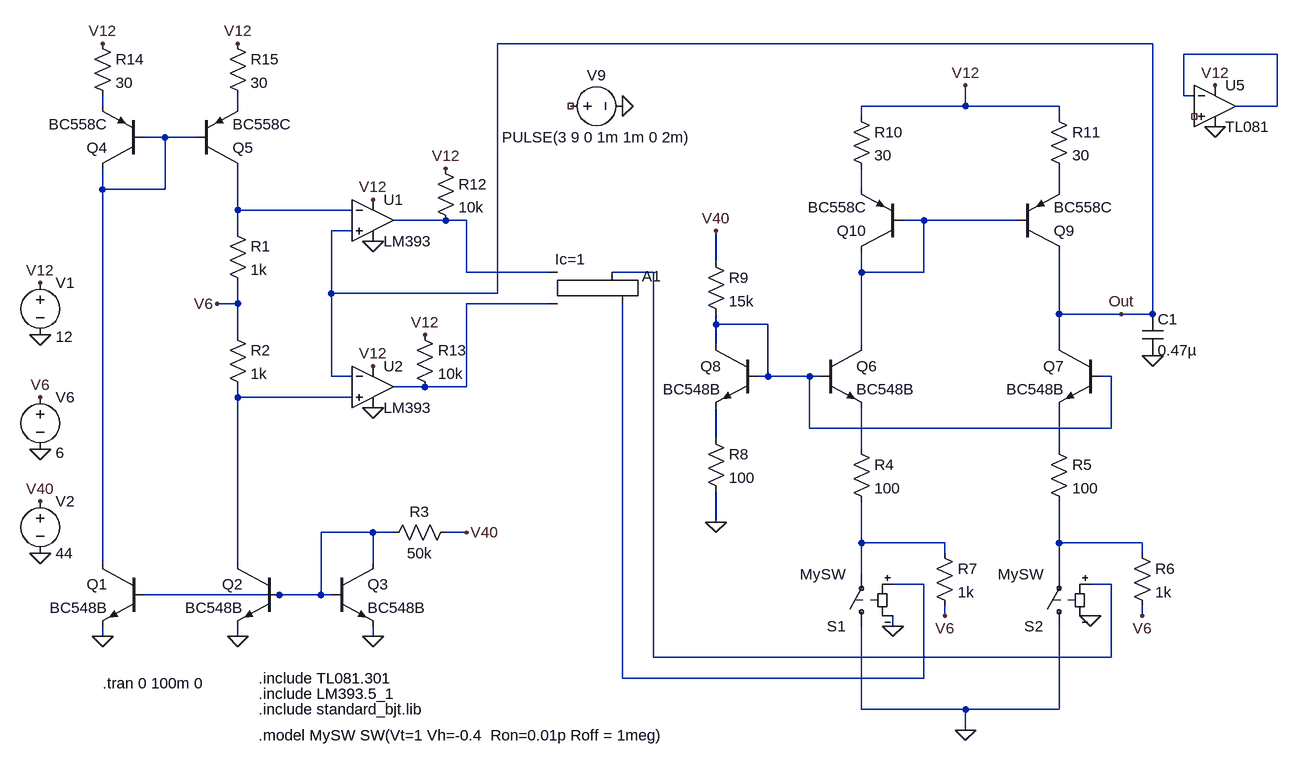
[diagram p0: schematic Gen_triangular_v5.asc]
Gen_triangular_v5.asc, the LTspice schematic file:
Version 4
SHEET 1 2480 932
WIRE 1792 -528 784 -528
WIRE 1984 -512 1840 -512
WIRE 1840 -448 1840 -512
WIRE 1856 -448 1840 -448
WIRE 176 -432 176 -448
WIRE 384 -432 384 -448
WIRE 1504 -432 1504 -464
WIRE 1504 -432 1344 -432
WIRE 1648 -432 1504 -432
WIRE 1984 -432 1984 -512
WIRE 1984 -432 1920 -432
WIRE 1344 -416 1344 -432
WIRE 1648 -416 1648 -432
WIRE 272 -384 240 -384
WIRE 320 -384 272 -384
WIRE 176 -304 176 -336
WIRE 272 -304 272 -384
WIRE 272 -304 176 -304
WIRE 1344 -304 1344 -336
WIRE 1648 -304 1648 -336
WIRE 384 -272 384 -336
WIRE 560 -272 384 -272
WIRE 704 -256 624 -256
WIRE 736 -256 704 -256
WIRE 1440 -256 1408 -256
WIRE 1584 -256 1440 -256
WIRE 384 -240 384 -272
WIRE 560 -240 528 -240
WIRE 1120 -192 1120 -240
WIRE 736 -176 736 -256
WIRE 864 -176 736 -176
WIRE 1024 -176 960 -176
WIRE 1344 -176 1344 -208
WIRE 1440 -176 1440 -256
WIRE 1440 -176 1344 -176
WIRE 528 -144 528 -240
WIRE 784 -144 784 -528
WIRE 784 -144 528 -144
WIRE 384 -128 384 -160
WIRE 384 -128 352 -128
WIRE 864 -128 736 -128
WIRE 1648 -112 1648 -208
WIRE 1744 -112 1648 -112
WIRE 1792 -112 1792 -528
WIRE 1792 -112 1744 -112
WIRE 1120 -96 1120 -112
WIRE 1200 -96 1120 -96
WIRE 384 -80 384 -128
WIRE 1120 -64 1120 -96
WIRE 1344 -64 1344 -176
WIRE 1648 -64 1648 -112
WIRE 528 -16 528 -144
WIRE 560 -16 528 -16
WIRE 1200 -16 1200 -96
WIRE 1200 -16 1184 -16
WIRE 1264 -16 1200 -16
WIRE 1280 -16 1264 -16
WIRE 1728 -16 1712 -16
WIRE 672 0 624 0
WIRE 736 0 736 -128
WIRE 736 0 672 0
WIRE 384 16 384 0
WIRE 560 16 384 16
WIRE 1264 64 1264 -16
WIRE 1728 64 1728 -16
WIRE 1728 64 1264 64
WIRE 1120 80 1120 32
WIRE 1344 96 1344 32
WIRE 1648 96 1648 32
WIRE 1120 208 1120 160
WIRE 592 224 512 224
WIRE 624 224 592 224
WIRE 736 224 704 224
WIRE 1344 240 1344 176
WIRE 1472 240 1344 240
WIRE 1648 240 1648 176
WIRE 1776 240 1648 240
WIRE 1472 256 1472 240
WIRE 1776 256 1776 240
WIRE 176 272 176 -304
WIRE 384 272 384 16
WIRE 592 272 592 224
WIRE 1344 288 1344 240
WIRE 1648 288 1648 240
WIRE 1440 304 1392 304
WIRE 1728 304 1696 304
WIRE 448 320 240 320
WIRE 512 320 512 224
WIRE 512 320 448 320
WIRE 528 320 512 320
WIRE 1472 352 1472 336
WIRE 1776 352 1776 336
WIRE 1392 368 1392 352
WIRE 176 384 176 368
WIRE 384 384 384 368
WIRE 592 384 592 368
WIRE 1024 416 1024 -176
WIRE 1728 416 1728 304
WIRE 1728 416 1024 416
WIRE 976 448 976 -128
WIRE 1440 448 1440 304
WIRE 1440 448 976 448
WIRE 1344 496 1344 368
WIRE 1504 496 1344 496
WIRE 1648 496 1648 368
WIRE 1648 496 1504 496
WIRE 1504 528 1504 496
FLAG 592 384 0
FLAG 384 384 0
FLAG 176 384 0
FLAG 80 -80 0
FLAG 352 -128 V6
FLAG 80 -160 V12
FLAG 384 -528 V12
FLAG 176 -528 V12
FLAG 592 -224 0
FLAG 592 32 0
FLAG 592 -288 V12
FLAG 592 -32 V12
FLAG 1888 -400 0
FLAG 1888 -464 V12
FLAG 1120 208 0
FLAG 1776 352 V6
FLAG 1472 352 V6
FLAG 1120 -240 V40
FLAG 1792 -48 0
FLAG 1504 -464 V12
FLAG 1744 -112 Out
FLAG 80 96 0
FLAG 80 16 V6
FLAG 1504 528 0
FLAG 1392 368 0
FLAG 1696 352 0
FLAG 704 -336 V12
FLAG 672 -80 V12
FLAG 976 -432 0
FLAG 80 256 0
FLAG 80 176 V40
FLAG 736 224 V40
SYMBOL npn 240 272 M0
SYMATTR InstName Q1
SYMATTR Value BC548B
SYMBOL npn 448 272 M0
SYMATTR InstName Q2
SYMATTR Value BC548B
SYMBOL npn 528 272 R0
SYMATTR InstName Q3
SYMATTR Value BC548B
SYMBOL pnp 240 -336 R180
SYMATTR InstName Q4
SYMATTR Value BC558C
SYMBOL pnp 320 -336 M180
SYMATTR InstName Q5
SYMATTR Value BC558C
SYMBOL res 368 -256 R0
SYMATTR InstName R1
SYMATTR Value 1k
SYMBOL res 368 -96 R0
SYMATTR InstName R2
SYMATTR Value 1k
SYMBOL voltage 80 -176 R0
WINDOW 123 0 0 Left 0
WINDOW 39 0 0 Left 0
WINDOW 3 24 99 Left 2
SYMATTR Value 12
SYMATTR InstName V1
SYMBOL Opamps\\opamp2 592 -320 R0
SYMATTR InstName U1
SYMATTR Value LM393
SYMBOL Opamps\\opamp2 592 -64 R0
SYMATTR InstName U2
SYMATTR Value LM393
SYMBOL Digital\\srflop 912 -224 R0
WINDOW 3 -40 28 Left 2
SYMATTR Value Ic=1
SYMATTR InstName A1
SYMBOL Opamps\\opamp2 1888 -496 R0
SYMATTR InstName U5
SYMATTR Value TL081
SYMBOL npn 1280 -64 R0
SYMATTR InstName Q6
SYMATTR Value BC548B
SYMBOL npn 1712 -64 M0
SYMATTR InstName Q7
SYMATTR Value BC548B
SYMBOL res 1328 80 R0
SYMATTR InstName R4
SYMATTR Value 100
SYMBOL res 1632 80 R0
SYMATTR InstName R5
SYMATTR Value 100
SYMBOL res 1760 240 R0
SYMATTR InstName R6
SYMATTR Value 1k
SYMBOL res 1456 240 R0
SYMATTR InstName R7
SYMATTR Value 1k
SYMBOL npn 1184 -64 M0
SYMATTR InstName Q8
SYMATTR Value BC548B
SYMBOL res 1104 64 R0
SYMATTR InstName R8
SYMATTR Value 100
SYMBOL res 1104 -208 R0
SYMATTR InstName R9
SYMATTR Value 15k
SYMBOL cap 1776 -112 R0
SYMATTR InstName C1
SYMATTR Value 0.47µ
SYMBOL pnp 1584 -208 M180
SYMATTR InstName Q9
SYMATTR Value BC558C
SYMBOL pnp 1408 -208 R180
SYMATTR InstName Q10
SYMATTR Value BC558C
SYMBOL res 1328 -432 R0
SYMATTR InstName R10
SYMATTR Value 30
SYMBOL res 1632 -432 R0
SYMATTR InstName R11
SYMATTR Value 30
SYMBOL voltage 80 0 R0
WINDOW 123 0 0 Left 0
WINDOW 39 0 0 Left 0
WINDOW 3 24 101 Left 2
SYMATTR InstName V6
SYMATTR Value 6
SYMBOL sw 1344 384 R180
SYMATTR InstName S1
SYMATTR Value MySW
SYMBOL sw 1648 384 R180
SYMATTR InstName S2
SYMATTR Value MySW
SYMBOL res 688 -352 R0
SYMATTR InstName R12
SYMATTR Value 10k
SYMBOL res 656 -96 R0
SYMATTR InstName R13
SYMATTR Value 10k
SYMBOL voltage 880 -432 R270
WINDOW 0 32 56 VTop 2
WINDOW 3 -32 56 VBottom 2
WINDOW 123 0 0 Left 0
WINDOW 39 0 0 Left 0
SYMATTR InstName V9
SYMATTR Value PULSE(3 9 0 1m 1m 0 2m)
SYMBOL res 160 -544 R0
SYMATTR InstName R14
SYMATTR Value 30
SYMBOL res 368 -544 R0
SYMATTR InstName R15
SYMATTR Value 30
SYMBOL res 720 208 R90
WINDOW 0 0 56 VBottom 2
WINDOW 3 32 56 VTop 2
SYMATTR InstName R3
SYMATTR Value 50k
SYMBOL voltage 80 160 R0
WINDOW 123 0 0 Left 0
WINDOW 39 0 0 Left 0
SYMATTR InstName V2
SYMATTR Value 44
TEXT 416 496 Left 2 !.include standard_bjt.lib
TEXT 176 456 Left 2 !.tran 0 100m 0
TEXT 416 472 Left 2 !.include LM393.5_1
TEXT 416 448 Left 2 !.include TL081.301
TEXT 416 536 Left 2 !.model MySW SW(Vt=1 Vh=-0.4  Ron=0.01p Roff = 1meg)

The netlist it stands for:
* Gen_triangular_v5.asc
Q1 N004 N017 0 0 BC548B
Q2 N013 N017 0 0 BC548B
Q3 N017 N017 0 0 BC548B
Q4 N004 N004 N002 0 BC558C
Q5 N007 N004 N003 0 BC558C
R1 N007 V6 1k
R2 V6 N013 1k
V1 V12 0 12
XU1 Out N007 V12 0 N008 LM393  ; pins In+ In- V+ V- OUT
XU2 N013 Out V12 0 N011 LM393  ; pins In+ In- V+ V- OUT
A1 N008 N011 0 0 0 N020 N010 0 SRFLOP Ic=1
XU5 NC_01 N001 V12 0 N001 TL081  ; pins In+ In- V+ V- OUT
Q6 N009 N012 N015 0 BC548B
Q7 Out N012 N016 0 BC548B
R4 N015 N018 100
R5 N016 N019 100
R6 N019 V6 1k
R7 N018 V6 1k
Q8 N012 N012 N014 0 BC548B
R8 N014 0 100
R9 V40 N012 15k
C1 Out 0 0.47µ
Q9 Out N009 N006 0 BC558C
Q10 N009 N009 N005 0 BC558C
R10 V12 N005 30
R11 V12 N006 30
V6 V6 0 6
S1 0 N018 N020 0 MySW
S2 0 N019 N010 0 MySW
R12 V12 N008 10k
R13 V12 N011 10k
V9 NC_02 0 PULSE(3 9 0 1m 1m 0 2m)
R14 V12 N002 30
R15 V12 N003 30
R3 V40 N017 50k
V2 V40 0 44
.model NPN NPN
.model PNP PNP
.lib standard.bjt
.include standard_bjt.lib
.tran 0 100m 0
.include LM393.5_1
.include TL081.301
.model MySW SW(Vt=1 Vh=-0.4  Ron=0.01p Roff = 1meg)
.backanno
.end